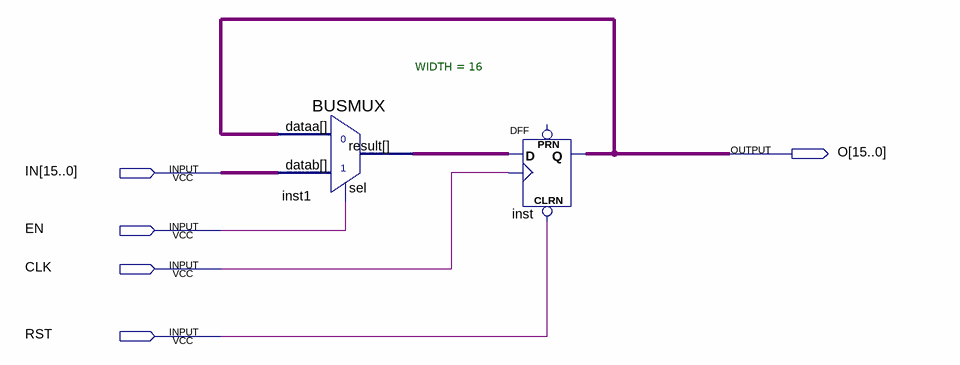
[diagram p0: schematic sheet]
// Quartus schematic REGISTER16BIT.bdf as structural Verilog: 2 symbols, 5 pins
module REGISTER16BIT (
  input  [15:0] IN,
  input  EN,
  input  CLK,
  input  RST,
  output [15:0] O
);

  wire [15:0] inst1_result;

  BUSMUX #(.WIDTH(16)) inst1 (.datab(IN), .sel(EN), .dataa(O), .result(inst1_result));
  DFF inst[15:0] (.CLRN(RST), .CLK(CLK), .D(inst1_result), .Q(O));  // open: PRN
endmodule
